# Altium project Air_Logger_PCB.PrjPcb
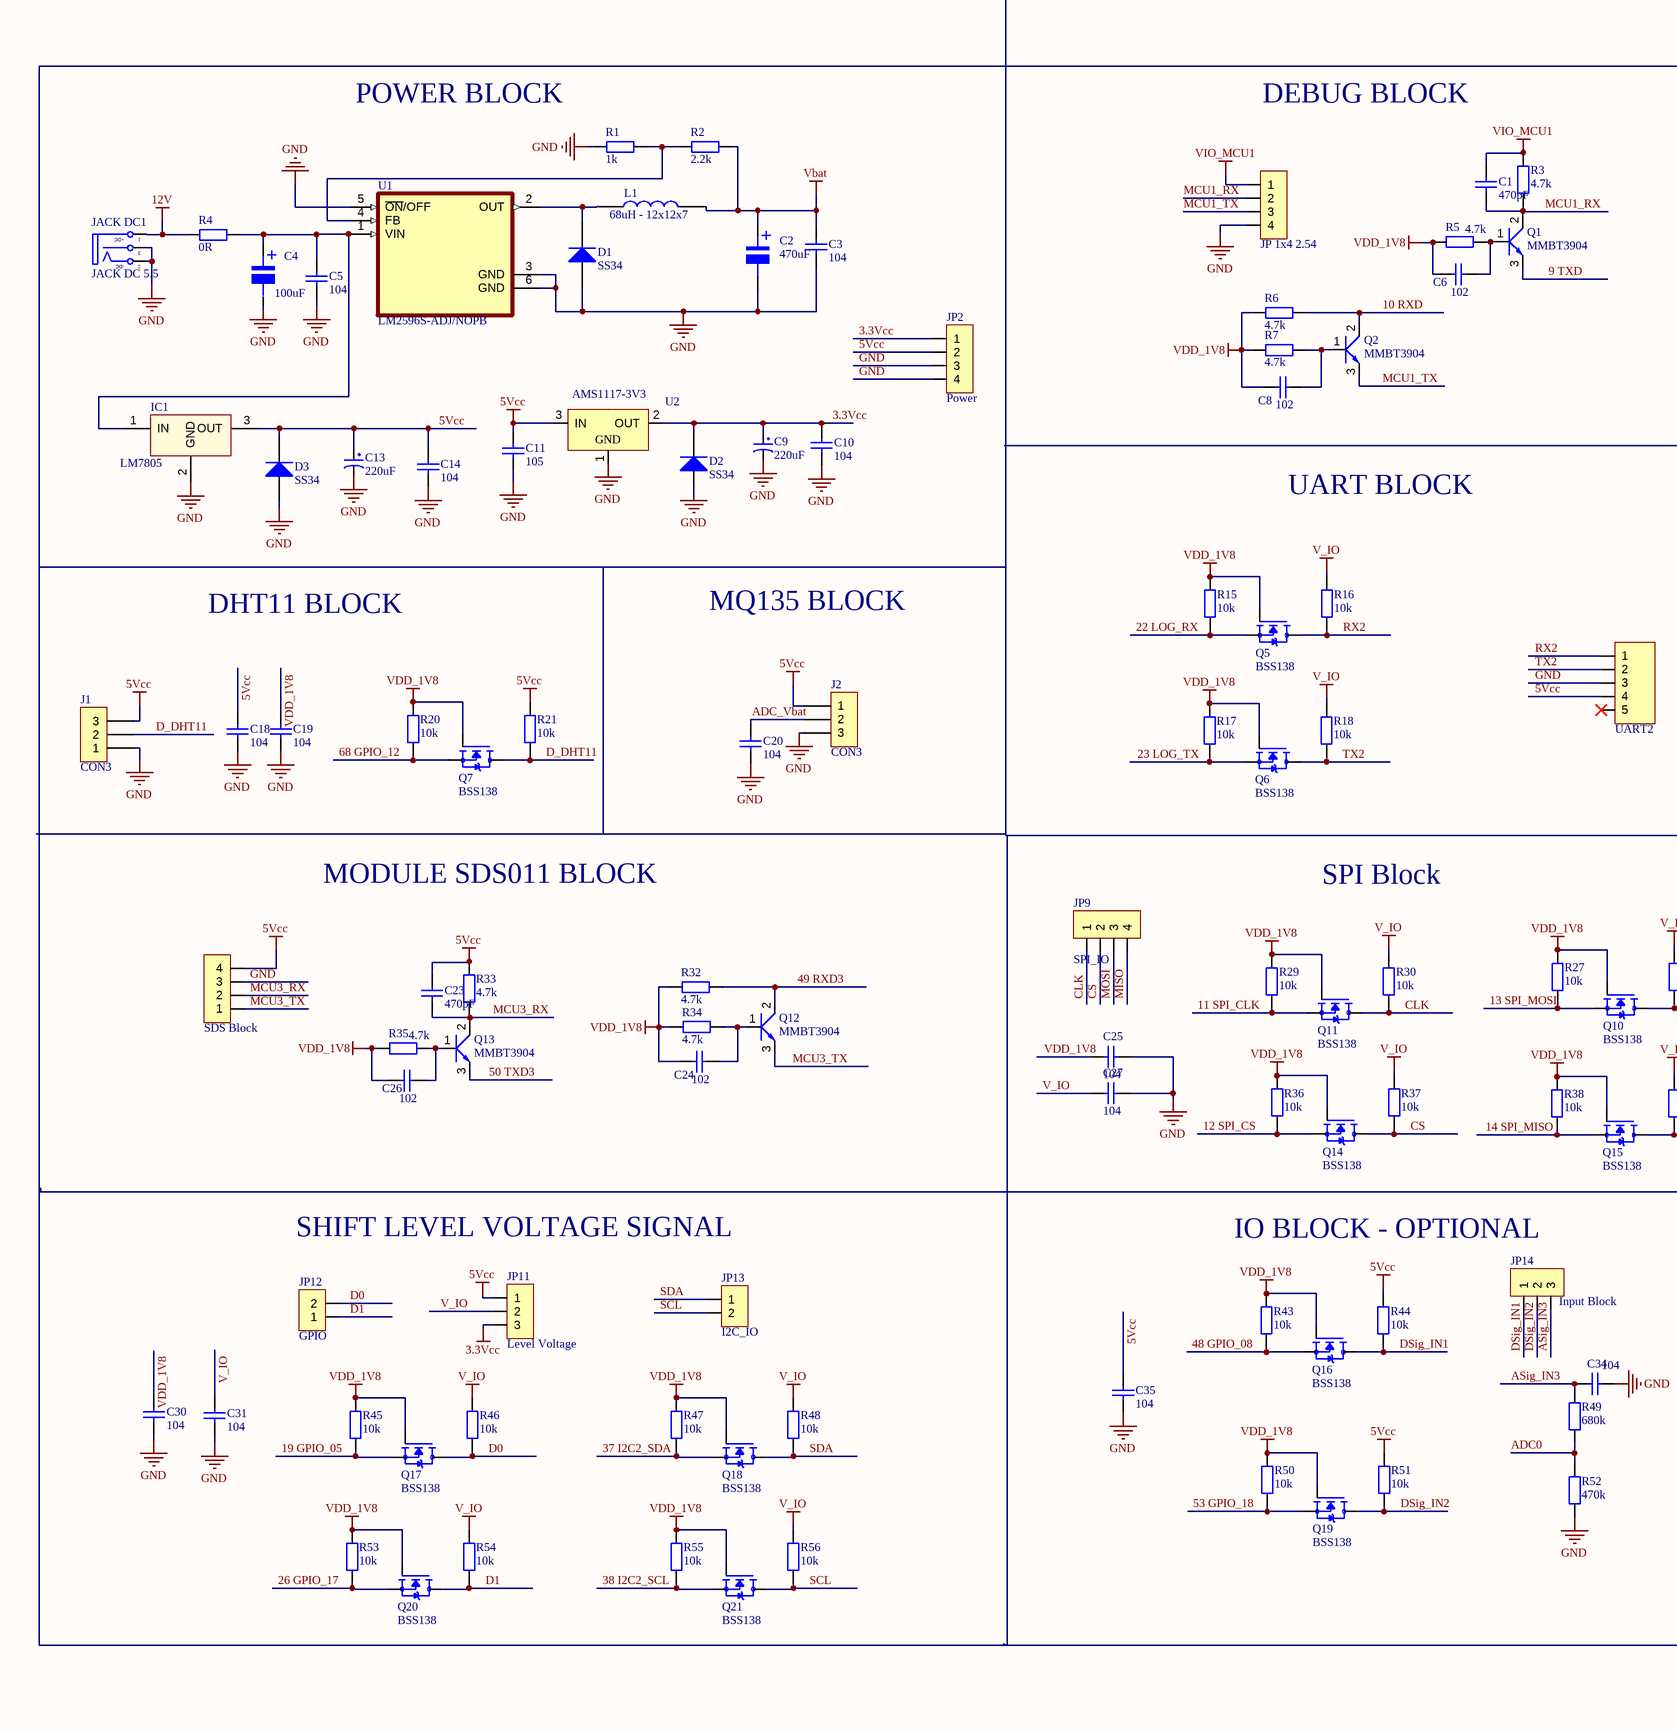
[diagram p0: Air_Logger_Sch_ver2.SchDoc, left]
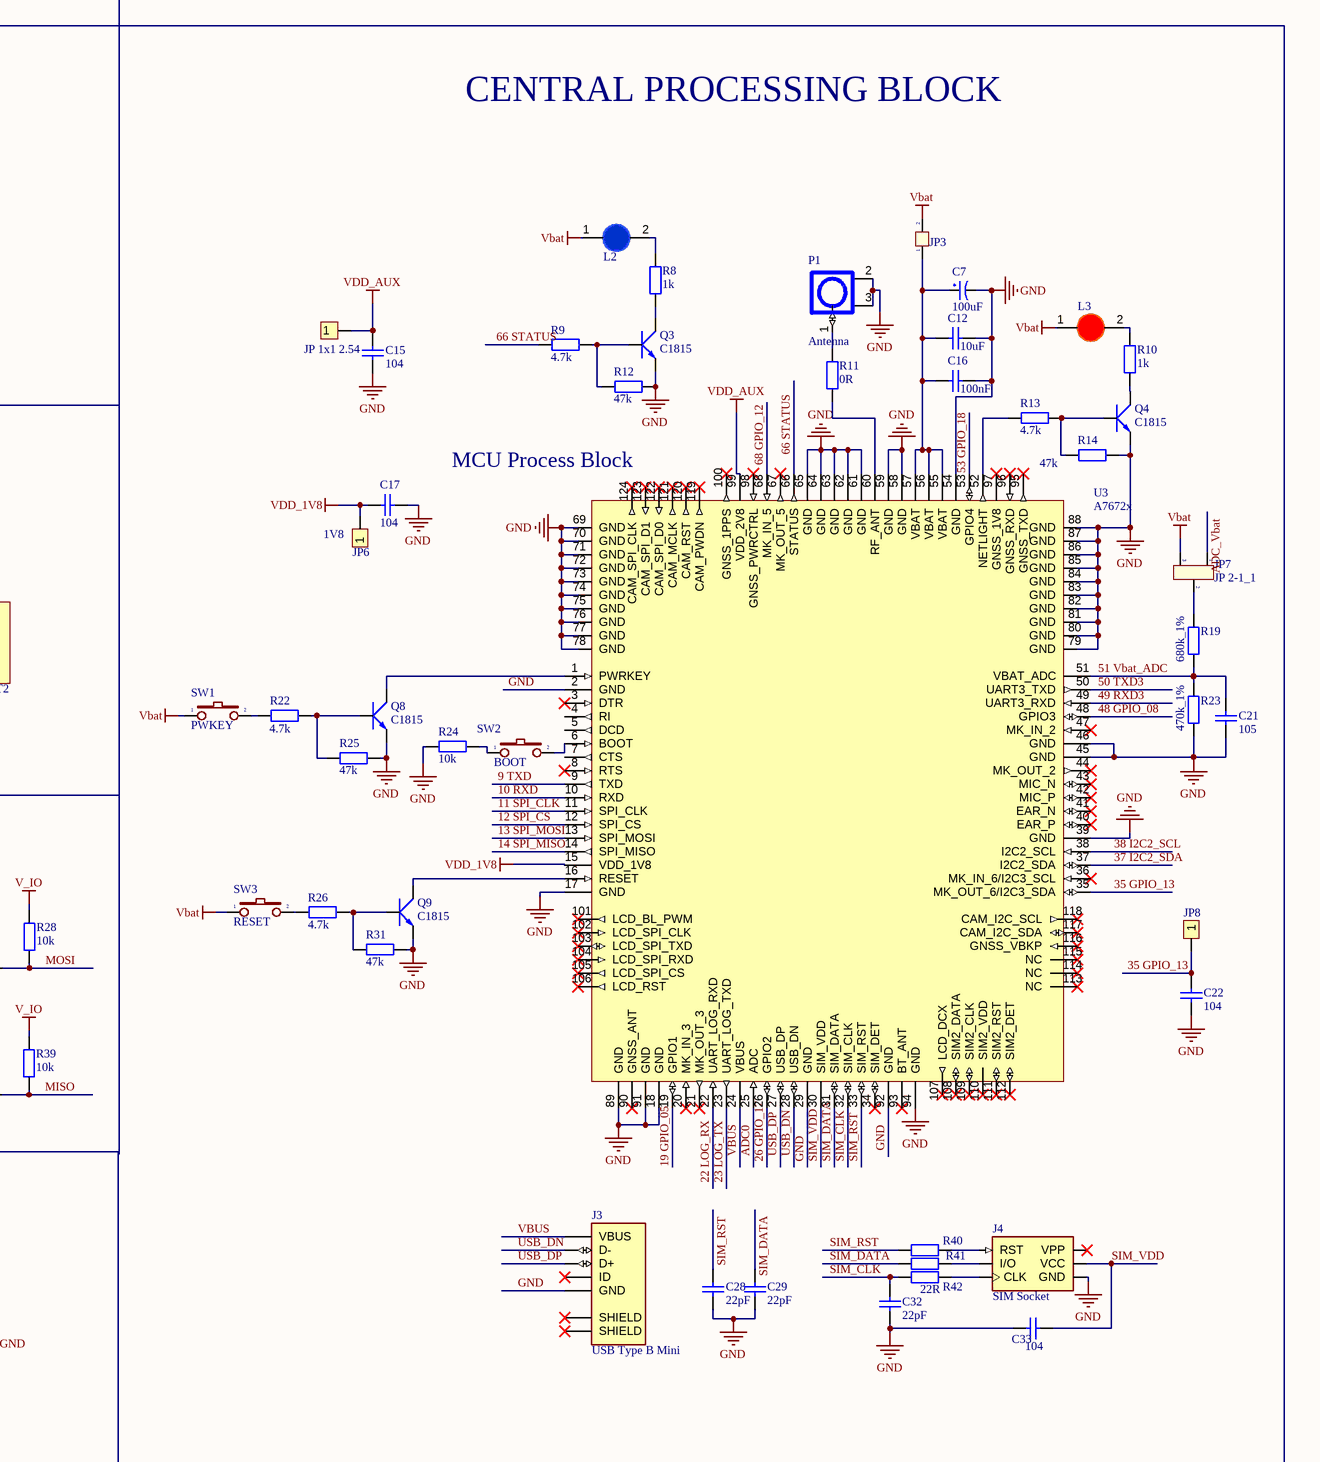
[diagram p1: Air_Logger_Sch_ver2.SchDoc, right]
1 sheet, 145 parts. Net scope: global (net labels, ports and power ports of the same name join across sheets).
Board file: Air_Logger_PCB_ver2.PcbDoc

## Sheet Air_Logger_Sch_ver2.SchDoc
size 594 x 420 mm; SheetNumber: 1; SheetTotal: 1

### Parts
C1  470pF  [tu 1206]
C2  470uF  [tu nhom 8 (f)]
C3  104  [tu 1206]
C4  100uF  [tu nhom 6.3 (d)]
C5  104  [tu 1206]
C6  102  [tu 1206]
C7  100uF  [tu tantalum smd6032]
C8  102  [tu 1206]
C9  220uF  [tu tantalum smd7343]
C10  104  [tu 1206]
C11  105  [tu 1206]
C12  10uF  [tu 1206]
C13  220uF  [tu tantalum smd7343]
C14  104  [tu 1206]
C15  104  [tu 0805]
C16  100nF  [tu 1206]
C17  104  [tu 1206]
C18  104  [tu 0805]
C19  104  [tu 0805]
C20  104  [tu 0805]
C21  105  [tu 0805]
C22  104  [tu 0805]
C23  470pF  [tu 1206]
C24  102  [tu 1206]
C25  104  [tu 0805]
C26  102  [tu 1206]
C27  104  [tu 0805]
C28  22pF  [tu 0805]
C29  22pF  [tu 0805]
C30  104  [tu 0805]
C31  104  [tu 0805]
C32  22pF  [tu 0805]
C33  104  [tu 1206]
C34  104  [tu 0805]
C35  104  [tu 0805]
D1  SS34  [DIODE SMA]
D2  SS34  [DIODE SMA]
D3  SS34  [DIODE SMA]
IC1  LM7805  [TO-252]
J1  CON3  [CON3]
J2  CON3  [CON3]
J3  USB Type B Mini  [GCT_USB3106-XX-0230-X_REVB]
J4  SIM Socket  [GCT_SIM5051-6-0-18-00-X_REVF]
JACK_DC1  JACK DC 5.5  [JACK DC 5.5]
JP1  JP 1x4 2.54  [JP 1x4 DT]
JP2  Power  [JP 1x4 DT]
JP3  Jumper 2  [J2]  (value not drawn)
JP4  JP 1x1 2.54  [JP 1x1 DT]
JP5  UART2  [JP 1x5 DT]
JP6  1V8  [JP 1x1 DT]
JP7  JP 2-1_1  [JP3]
JP8  JP 1x1 2.54  [JP 1x1 DT]  (value not drawn)
JP9  SPI_IO  [JP 1x4 DT]
JP10  SDS Block  [JP 1x4 DT]
JP11  Level Voltage  [JP 1x3 DT]
JP12  GPIO  [JP 1x2 DT]
JP13  I2C_IO  [JP 1x2 DT]
JP14  Input Block  [JP 1x3 DT]
L1  68uH - 12x12x7  [Cuon Cam 12x12x10]
L2  LED 0805  [LED-1206-Blue]  (value not drawn)
L3  LED 0805  [LED-1206-Red]  (value not drawn)
P1  Antenna  [IPXS]
Q1  MMBT3904  [SOT23B C1815]
Q2  MMBT3904  [SOT23B C1815]
Q3  C1815  [SOT23B]
Q4  C1815  [SOT23B]
Q5  BSS138  [SOT95P240X111-3N]
Q6  BSS138  [SOT95P240X111-3N]
Q7  BSS138  [SOT95P240X111-3N]
Q8  C1815  [SOT23B]
Q9  C1815  [SOT23B]
Q10  BSS138  [SOT95P240X111-3N]
Q11  BSS138  [SOT95P240X111-3N]
Q12  MMBT3904  [SOT23B C1815]
Q13  MMBT3904  [SOT23B C1815]
Q14  BSS138  [SOT95P240X111-3N]
Q15  BSS138  [SOT95P240X111-3N]
Q16  BSS138  [SOT95P240X111-3N]
Q17  BSS138  [SOT95P240X111-3N]
Q18  BSS138  [SOT95P240X111-3N]
Q19  BSS138  [SOT95P240X111-3N]
Q20  BSS138  [SOT95P240X111-3N]
Q21  BSS138  [SOT95P240X111-3N]
R1  1k  [tro smd 1206]
R2  2.2k  [tro smd 1206]
R3  4.7k  [tro smd 1206]
R4  0R  [tro smd 1206]
R5  4.7k  [tro smd 1206]
R6  4.7k  [tro smd 1206]
R7  4.7k  [tro smd 1206]
R8  1k  [tro smd 0805]
R9  4.7k  [tro smd 0805]
R10  1k  [tro smd 0805]
R11  0R  [tro smd 0805]
R12  47k  [tro smd 1206]
R13  4.7k  [tro smd 0805]
R14  47k  [tro smd 1206]
R15  10k  [tro smd 1206]
R16  10k  [tro smd 1206]
R17  10k  [tro smd 1206]
R18  10k  [tro smd 1206]
R19  680k_1%  [Tro SMD 0805]
R20  10k  [tro smd 1206]
R21  10k  [tro smd 1206]
R22  4.7k  [tro smd 0805]
R23  470k_1%  [tro smd 0805]
R24  10k  [tro smd 1206]
R25  47k  [tro smd 1206]
R26  4.7k  [tro smd 0805]
R27  10k  [tro smd 1206]
R28  10k  [tro smd 1206]
R29  10k  [tro smd 1206]
R30  10k  [tro smd 1206]
R31  47k  [tro smd 1206]
R32  4.7k  [tro smd 1206]
R33  4.7k  [tro smd 1206]
R34  4.7k  [tro smd 1206]
R35  4.7k  [tro smd 1206]
R36  10k  [tro smd 1206]
R37  10k  [tro smd 1206]
R38  10k  [tro smd 1206]
R39  10k  [tro smd 1206]
R40  22R  [Tro smd 1206]  (value not drawn)
R41  22R  [Tro smd 1206]  (value not drawn)
R42  22R  [Tro smd 1206]
R43  10k  [tro smd 1206]
R44  10k  [tro smd 1206]
R45  10k  [tro smd 1206]
R46  10k  [tro smd 1206]
R47  10k  [tro smd 1206]
R48  10k  [tro smd 1206]
R49  680k  [Tro SMD 0805]
R50  10k  [tro smd 1206]
R51  10k  [tro smd 1206]
R52  470k  [tro smd 0805]
R53  10k  [tro smd 1206]
R54  10k  [tro smd 1206]
R55  10k  [tro smd 1206]
R56  10k  [tro smd 1206]
SW1  PWKEY  [sw_ran_2pin]
SW2  BOOT  [sw_ran_2pin]
SW3  RESET  [sw_ran_2pin]
U1  LM2596S-ADJ/NOPB  [VREG_LM2596S-ADJ/NOPB]
U2  AMS1117-3V3  [AMS1117-3.3V]
U3  A7672x  [A7672]

### Nets
3.3Vcc: C9.1 C10.1 D2.2(K) JP2.1 JP11.3 U2.2(OUT)
5Vcc: C11.1 C13.1 C14.1 C18.1 C23.1 C35.1 D3.2(K) IC1.3(OUT) J1.3 J2.1 JP2.2 JP5.4 JP10.4 JP11.1 R21.2 R33.2 R44.2 R51.2 U2.3(IN)
12V: JACK_DC1.1(T) R4.1
GND: C2.2 C3.2 C4.2 C5.2 C7.2 C9.2 C10.2 C11.2 C12.1 C13.2 C14.2 C15.2 C16.1 C17.2 C18.2 C19.2 C20.2 C21.2 C22.2 C25.1 C27.1 C28.2 C29.2 C30.2 C31.2 C32.2 C33.2 C34.1 C35.2 D1.1(A) D2.1(A) D3.1(A) IC1.2(GND) J1.1 J2.3 J3.5(GND) J4.C5(GND) JACK_DC1.2(TN) JACK_DC1.3(S) JP1.4 JP2.3 JP2.4 JP5.3 JP10.3 P1.2 P1.3 Q3.1(E) Q4.1(E) Q8.1(E) Q9.1(E) R1.2 R12.2 R14.1 R23.1 R24.1 R25.1 R31.2 R52.1 U1.3(GND) U1.5(~{ON}/OFF) U1.6(GND) U2.1(GND) U3.2(GND) U3.17(GND) U3.18(GND) U3.29(GND) U3.39(GND) U3.45(GND) U3.46(GND) U3.54(GND) U3.58(GND) U3.59(GND) U3.61(GND) U3.62(GND) U3.63(GND) U3.64(GND) U3.65(GND) U3.69(GND) U3.70(GND) U3.71(GND) U3.72(GND) U3.73(GND) U3.74(GND) U3.75(GND) U3.76(GND) U3.77(GND) U3.78(GND) U3.79(GND) U3.80(GND) U3.81(GND) U3.82(GND) U3.83(GND) U3.84(GND) U3.85(GND) U3.86(GND) U3.87(GND) U3.88(GND) U3.89(GND) U3.91(GND) U3.92(GND) U3.94(GND)
V_IO: C27.2 C31.1 JP11.2 R16.2 R18.2 R28.2 R30.2 R37.2 R39.2 R46.2 R48.2 R54.2 R56.2
Vbat: C2.1 C3.1 JP3.2 JP7.3 L1.2 L2.1(A) L3.1(A) R2.2 SW1.1 SW3.1
VDD_1V8: C6.2 C8.2 C17.1 C19.1 C24.2 C25.2 C26.2 C30.1 JP6.1 Q5.1(G) Q6.1(G) Q7.1(G) Q10.1(G) Q11.1(G) Q14.1(G) Q15.1(G) Q16.1(G) Q17.1(G) Q18.1(G) Q19.1(G) Q20.1(G) Q21.1(G) R5.1 R6.1 R7.1 R15.2 R17.2 R20.2 R27.2 R29.2 R32.1 R34.1 R35.1 R36.2 R38.2 R43.2 R45.2 R47.2 R50.2 R53.2 R55.2 U3.15(VDD_1V8)
VDD_AUX: C15.1 JP4.1 U3.99(VDD_2V8)
VIO_MCU1: C1.1 JP1.1 R3.2
9 TXD: Q1.3(E) U3.9(TXD)
10 RXD: Q2.2(C) R6.2 U3.10(RXD)
11 SPI_CLK: Q11.2(S) R29.1 U3.11(SPI_CLK)
12 SPI_CS: Q14.2(S) R36.1 U3.12(SPI_CS)
13 SPI_MOSI: Q10.2(S) R27.1 U3.13(SPI_MOSI)
14 SPI_MISO: Q15.2(S) R38.1 U3.14(SPI_MISO)
19 GPIO_05: Q17.2(S) R45.1 U3.19(GPIO1)
22 LOG_RX: Q5.2(S) R15.1 U3.22(UART_LOG_RXD)
23 LOG_TX: Q6.2(S) R17.1 U3.23(UART_LOG_TXD)
26 GPIO_17: Q20.2(S) R53.1 U3.26(GPIO2)
35 GPIO_13: C22.1 JP8.1 U3.35(MK_OUT_6/I2C3_SDA)
37 I2C2_SDA: Q18.2(S) R47.1 U3.37(I2C2_SDA)
38 I2C2_SCL: Q21.2(S) R55.1 U3.38(I2C2_SCL)
48 GPIO_08: Q16.2(S) R43.1 U3.48(GPIO3)
49 RXD3: Q12.2(C) R32.2 U3.49(UART3_RXD)
50 TXD3: Q13.3(E) U3.50(UART3_TXD)
51 Vbat_ADC: C21.1 R19.1 R23.2 U3.51(VBAT_ADC)
53 GPIO_18: Q19.2(S) R50.1 U3.53(GPIO4)
66 STATUS: R9.1 U3.66(STATUS)
68 GPIO_12: Q7.2(S) R20.1 U3.68(MK_IN_5)
ADC0: R49.1 R52.2 U3.25(ADC)
ADC_Vbat: C20.1 J2.2 JP7.1
ASig_IN3: C34.2 JP14.3 R49.2
CLK: JP9.1 Q11.3(D) R30.1
CS: JP9.2 Q14.3(D) R37.1
D0: JP12.2 Q17.3(D) R46.1
D1: JP12.1 Q20.3(D) R54.1
D_DHT11: J1.2 Q7.3(D) R21.1
DSig_IN1: JP14.1 Q16.3(D) R44.1
DSig_IN2: JP14.2 Q19.3(D) R51.1
MCU1_RX: C1.2 JP1.2 Q1.2(C) R3.1
MCU1_TX: JP1.3 Q2.3(E)
MCU3_RX: C23.2 JP10.2 Q13.2(C) R33.1
MCU3_TX: JP10.1 Q12.3(E)
MISO: JP9.4 Q15.3(D) R39.1
MOSI: JP9.3 Q10.3(D) R28.1
RX2: JP5.1 Q5.3(D) R16.1
SCL: JP13.2 Q21.3(D) R56.1
SDA: JP13.1 Q18.3(D) R48.1
SIM_CLK: C32.1 R42.1 U3.32(SIM_CLK)
SIM_DATA: C29.1 R41.1 U3.31(SIM_DATA)
SIM_RST: C28.1 R40.1 U3.33(SIM_RST)
SIM_VDD: C33.1 J4.C1(VCC) U3.30(SIM_VDD)
TX2: JP5.2 Q6.3(D) R18.1
USB_DN: J3.2(D-) U3.28(USB_DN)
USB_DP: J3.3(D+) U3.27(USB_DP)
VBUS: J3.1(VBUS) U3.24(VBUS)
NetC4_1: C4.1 C5.1 IC1.1(IN) R4.2 U1.1(VIN)
NetC6_1: C6.1 Q1.1(B) R5.2
NetC7_1: C7.1 C12.2 C16.2 JP3.1 U3.55(VBAT) U3.56(VBAT) U3.57(VBAT)
NetC8_1: C8.1 Q2.1(B) R7.2
NetC24_1: C24.1 Q12.1(B) R34.2
NetC26_1: C26.1 Q13.1(B) R35.2
NetD1_2: D1.2(K) L1.1 U1.2(OUT)
NetJ4_C2: J4.C2(RST) R40.2
NetJ4_C3: J4.C3(CLK) R42.2
NetJ4_C7: J4.C7(I/O) R41.2
NetJP7_2: JP7.2 R19.2
NetL2_2: L2.2(K) R8.1
NetL3_2: L3.2(K) R10.2
NetP1_1: P1.1 R11.2
NetQ3_2: Q3.2(C) R8.2
NetQ3_3: Q3.3(B) R9.2 R12.1
NetQ4_2: Q4.2(C) R10.1
NetQ4_3: Q4.3(B) R13.2 R14.2
NetQ8_2: Q8.2(C) U3.1(PWRKEY)
NetQ8_3: Q8.3(B) R22.2 R25.2
NetQ9_2: Q9.2(C) U3.16(RESET)
NetQ9_3: Q9.3(B) R26.2 R31.1
NetR1_1: R1.1 R2.1 U1.4(FB)
NetR11_1: R11.1 U3.60(RF_ANT)
NetR13_1: R13.1 U3.52(NETLIGHT)
NetR22_1: R22.1 SW1.2
NetR24_2: R24.2 SW2.1
NetR26_1: R26.1 SW3.2
NetSW2_2: SW2.2 U3.6(BOOT)

Not connected (* = marked no-connect by the designer): J3 4(ID)* 6(SHIELD)* 7(SHIELD)*; J4 C6(VPP)*; JP5 5*; U2 4(OUT); U3 3(DTR)* 4(RI) 5(DCD) 7(CTS) 8(RTS)* 20(MK_IN_3)* 21(MK_OUT_3)* 34(SIM_DET)* 36(MK_IN_6/I2C3_SCL)* 40(EAR_P)* 41(EAR_N)* 42(MIC_P)* 43(MIC_N)* 44(MK_OUT_2)* 47(MK_IN_2)* 67(MK_OUT_5)* 90(GNSS_ANT)* 93(BT_ANT)* 95(GNSS_TXD)* 96(GNSS_RXD)* 97(GNSS_1V8)* 98(GNSS_PWRCTRL)* 100(GNSS_1PPS)* 101(LCD_BL_PWM)* 102(LCD_SPI_CLK)* 103(LCD_SPI_TXD)* 104(LCD_SPI_RXD)* 105(LCD_SPI_CS)* 106(LCD_RST)* 107(LCD_DCX)* 108(SIM2_DATA)* 109(SIM2_CLK)* 110(SIM2_VDD)* 111(SIM2_RST)* 112(SIM2_DET)* 113(NC)* 114(NC)* 115(NC)* 116(GNSS_VBKP)* 117(CAM_I2C_SDA)* 118(CAM_I2C_SCL)* 119(CAM_PWDN)* 120(CAM_RST)* 121(CAM_MCLK)* 122(CAM_SPI_D0)* 123(CAM_SPI_D1)* 124(CAM_SPI_CLK)*

### Notes on the sheet
- POWER BLOCK
- DEBUG BLOCK
- CENTRAL PROCESSING BLOCK
- UART BLOCK
- (near U3) MCU Process Block
- DHT11 BLOCK
- MQ135 BLOCK
- MODULE SDS011 BLOCK
- SPI Block
- SHIFT LEVEL VOLTAGE SIGNAL
- IO BLOCK - OPTIONAL
- DWG NO:
- REV:
- THIS DOCUMENT AND THE DATA DISCLOSED HEREIN OR
- HEREWITH IS THE PROPERTY OF ALTIUM LIMITED AND MAY
- BE FREELY DISTRIBUTED IN WHOLE. NO RIGHTS ARE
- RESERVED OR EXPRESS OR IMPLIED WARANTEE GIVEN.
- REVISION
- DESCRIPTION
- DATE
- APPROVED
- ENG:
- APPROVALS
- PROJECT
- DSN:
- CHK:
- REFERENCE DOCUMENTS
- PROJECT REVISION:
- TITLE
- DOCUMENT REVISION:
- DESIGN ITEM:
- BOM:
- FAB DWG:
- PCB DWG:
- ASSY DWG:
- SCALE:
- A2
- SIZE
- CAGE CODE
- FILE NAME
- DWG NO.
- SHEET
- OF
- REV
- (in symbol JACK DC 5.5) +DC; -DC
- (in symbol Tu Nhom 100uF 16V) +
- (in symbol Tu Nhom 470uF 16V) +

### Library data of the parts
C1 C23 = Tu 1206 470pF 50V 10%: Dán; Don_Vi: Con; So_Chan: 2; Ten_Linh_Kien: Tụ 1206 470P 10% 50V; Ma_Hang: MH004548; Chung_Loai: Dán; Kieu_Chan: *
C2 = Tu Nhom 470uF 16V: Dán; Don_Vi: Con; So_Chan: 2; Ten_Linh_Kien: Tụ Nhôm 470uF 16V 8x10.4MM; Ma_Hang: MH001940; Chung_Loai: Dán; Kieu_Chan: *
C3 C5 C10 C14 C16 C17 C33 = Tu 1206 104 50V 20%: Dán; Don_Vi: Con; So_Chan: 2; Ten_Linh_Kien: Tụ 1206 104-0.1uF 20% 50V; Ma_Hang: MH004544; Chung_Loai: Dán; Kieu_Chan: *
C4 = Tu Nhom 100uF 16V: Dán; Don_Vi: Con; So_Chan: 2; Ten_Linh_Kien: Tụ Nhôm 100uF 16V 6.3x5.4MM; Ma_Hang: MH002219; Chung_Loai: Dán; Kieu_Chan: *
C6 C8 C24 C26 = Tu 1206 102 50V 10%: Dán; Don_Vi: Con; So_Chan: 2; Ten_Linh_Kien: Tụ 1206 102-1nF 10% 50V; Ma_Hang: MH004542; Chung_Loai: Dán; Kieu_Chan: *
C7 = Tu tantalum 100uF 10V SMD6032: Dán; Don_Vi: Con; So_Chan: 2; Ten_Linh_Kien: Tụ tantalum 107A-100uF 10V SMD6032; Ma_Hang: MH007594; Chung_Loai: Dán; Kieu_Chan: *
C9 C13 = Tu tantalum 220uF 16V SMD7343: Dán; Don_Vi: Con; So_Chan: 2; Ten_Linh_Kien: Tụ tantalum 227C-220uF 16V SMD7343; Ma_Hang: MH002345; Chung_Loai: Dán; Kieu_Chan: *
C11 = Tu 1206 105 50V 20%: Dán; Don_Vi: Con; So_Chan: 2; Ten_Linh_Kien: Tụ 1206 105-1uF 20% 50V; Ma_Hang: MH004545; Chung_Loai: Dán; Kieu_Chan: *
C12 = Tu 1206 106 16V 20%: Dán; Don_Vi: Con; So_Chan: 2; Ten_Linh_Kien: Tụ 1206 106-10uF 20% 16V; Ma_Hang: MH004541; Chung_Loai: Dán; Kieu_Chan: *
C15 C18-C20 C22 C25 C27 C30 C31 C34 C35 = Tu 0805 104 50V 10%: Dán; Don_Vi: Con; So_Chan: 2; Ten_Linh_Kien: Tụ 0805 104-100nF 10% 50V; Ma_Hang: MH004551; Chung_Loai: Dán; Kieu_Chan: *
C21 = Tu 0805 105 50V 10%: Dán; Don_Vi: Con; So_Chan: 2; Ten_Linh_Kien: Tụ 0805 105-1uF 10% 50V; Ma_Hang: MH004552; Chung_Loai: Dán; Kieu_Chan: *
C28 C29 C32 = Tu 0805 22pF 50V 10%: Dán; Don_Vi: Con; So_Chan: 2; Ten_Linh_Kien: Tụ 0805 22P 10% 50V; Ma_Hang: MH004560; Chung_Loai: Dán; Kieu_Chan: *
D1-D3 = Diode SS34 ( 1N5822 ): Dán; Don_Vi: Con; Ma_Hang: MH002104; Ten_Linh_Kien: Diode SS34 3A 40V SMA ( 1N5822 SS34A); Kieu_Chan: *; Chung_Loai: Dán
IC1 = LM78xx: On ap +, from + 5 to + 24VDC; Value: LM7805
J1 J2 = CON3: Connector
J3 = USB3106-XX-0230-X_REVB: USB - micro AB USB 2.0 Receptacle Connector 5 Position Through Hole; MP: USB3106-30-0230-A; MF: Global Connector Technology; Price: None; SnapEDA_Link: https://www.snapeda.com/parts/USB3106-30-0230-A/Global%20Connector%20Technology/view-part/491956/?ref=snap; Availability: Unavailable; Value: *; Package: None
J4 = SIM5051-6-0-18-00-X_REVF: Memory Socket, Sim Card, 6pos; MP: SIM5051-6-0-18-00-A REV C; MF: Global Connector Technology; Availability: Unavailable; SnapEDA_Link: https://www.snapeda.com/parts/SIM5051-6-0-18-00-A%20REV%20C/Global%20Connector%20Technology/view-part/812969/?ref=snap; Price: None; Package: None; Value: *
JACK_DC1 = JACK DC 5.5: Value: Jac DC
JP1 JP2 JP9 JP10 = JP 1x4 2.54 Duc Thang: Cắm; Ten_Linh_Kien: Jump Đơn Đực 2.54MM 1x40P Thẳng 11MM; Don_Vi: Con; Ma_Hang: MH000903; Ghi_Chu: *; Kieu_Chan: *; Chung_Loai: Cắm
JP3 = JP 2_1: Value: JP 2
JP4 JP6 JP8 = JP 1x1 2.54 Duc Cong: Cắm; Ten_Linh_Kien: Jump Đơn Đực 2.54MM 1x40P Cong Đứng; Don_Vi: Con; Ma_Hang: MH000904; Ghi_Chu: *; Kieu_Chan: *; Chung_Loai: Cắm
JP5 = JP 1x5 2.54 Duc Thang: Cắm; Ten_Linh_Kien: Jump Đơn Đực 2.54MM 1x40P Thẳng 11MM; Don_Vi: Con; Ma_Hang: MH000903; Ghi_Chu: *; Kieu_Chan: *; Chung_Loai: Cắm
JP7 = JP 2-1_1: Jumper 2-1; Value: J2-1
JP11 JP14 = JP 1x3 2.54 Duc Thang: Cắm; Ten_Linh_Kien: Jump Đơn Đực 2.54MM 1x40P Thẳng 11MM; Don_Vi: Con; Ma_Hang: MH000903; Ghi_Chu: *; Kieu_Chan: *; Chung_Loai: Cắm
JP12 JP13 = JP 1x2 2.54 Duc Thang: Cắm; Ten_Linh_Kien: Jump Đơn Đực 2.54MM 1x40P Thẳng 11MM; Don_Vi: Con; Ma_Hang: MH000903; Ghi_Chu: *; Kieu_Chan: *; Chung_Loai: Cắm
L1 = CUON CAM 100uH SMD: Dán; Don_Vi: Con; Ma_Hang: MH003999; Ten_Linh_Kien: Cuộn Cảm 100uH 7x7x4MM CD74; Ma_Hang: *; Kieu_Chan: *; Chung_Loai: Dán
L2 = LED 1206 Xanh Duong: Dán; Don_Vi: Con; Ma_Hang: MH002333; Ten_Linh_Kien: LED1206 Màu Xanh Dương (Blue); Ghi_Chu: *; Kieu_Chan: *; Chung_Loai: Dán
L3 = LED 1206 Do: Dán; Don_Vi: Con; Ma_Hang: MH002334; Ten_Linh_Kien: LED1206 Màu Đỏ (Red); Ghi_Chu: *; Kieu_Chan: *; Chung_Loai: Dán
P1 = IPXSx66: Antenna GSM GPS
Q1 Q2 Q12 Q13 = C1815_2: NPN 600mW, ECB; Value: C1815
Q3 Q4 Q8 Q9 = C1815: NPN 600mW, ECB; Value: C1815
Q5-Q7 Q10 Q11 Q14-Q21 = BSS138: N-Channel 50V 220mA (Ta) 360mW (Ta) Surface Mount SOT-23-3; MF: ON Semiconductor; MP: BSS138; Price: None; SnapEDA_Link: https://www.snapeda.com/parts/BSS138/ON%20Semiconductor/view-part/4794929/?ref=snap; Availability: Good; Purchase-URL: https://pricing.snapeda.com/search/part/BSS138/?ref=eda; Value: *; Check_prices: https://www.snapeda.com/parts/BSS138/ON%20Semiconductor/view-part/4794929/?ref=eda; Package: SOT-23 ON Semiconductor
R1 = Tro 1206 1% 1k: Dán; Don_Vi: Con; So_Chan: 2; Ten_Linh_Kien: Trở 1206 1% 1k; Ma_Hang: MH005880; Chung_Loai: Dán; Kieu_Chan: *
R2 = Tro 1206 1% 2.2k: Dán; Chung_Loai: Cắm; Don_Vi: Con; So_Chan: 2; Ten_Linh_Kien: Trở 1206 1% 2.2k; Ma_Hang: MH005882; Kieu_Chan: *
R3 R5-R7 R32-R35 = Tro 1206 5% 4.7K: Dán; So_Chan: 2; Don_Vi: Con; Ten_Linh_Kien: Trở 1206 5% 4.7k; Ma_Hang: MH005908; Chung_Loai: Dán; Kieu_Chan: *
R4 = Tro 1206 5% 0R: Dán; Don_Vi: Con; So_Chan: 2; Ten_Linh_Kien: Trở 1206 5% 0R; Ma_Hang: MH005902; Chung_Loai: Dán; Kieu_Chan: *
R8 R10 = Tro 0805 5% 1k: Dán; Don_Vi: Con; So_Chan: 2; Ten_Linh_Kien: Trở 0805 5% 1k; Ma_Hang: MH005234; Chung_Loai: Dán; Kieu_Chan: *
R9 R13 R22 R26 = Tro 0805 5% 4.7k: Dán; Don_Vi: Con; So_Chan: 2; Ten_Linh_Kien: Trở 0805 5% 4.7k; Ma_Hang: MH005307; Chung_Loai: Dán; Kieu_Chan: *
R11 = Tro 0805 5% 0R: Dán; Don_Vi: Con; So_Chan: 2; Ten_Linh_Kien: Trở 0805 5% 0R; Ma_Hang: MH005230; Chung_Loai: Dán; Kieu_Chan: *
R12 R14 R25 R31 = Tro 1206 5% 47k: Dán; Don_Vi: Con; Ten_Linh_Kien: Trở 1206 5% 47k; Ma_Hang: MH005916; So_Chan: 2; Chung_Loai: Dán; Kieu_Chan: *
R15-R18 R20 R21 R27-R30 R36-R39 R43-R48 R50 R51 R53-R56 = Tro 1206 1% 10k: Dán; Don_Vi: Con; So_Chan: 2; Ten_Linh_Kien: Trở 1206 1% 10k; Ma_Hang: MH005885; Chung_Loai: Dán; Kieu_Chan: *
R19 R49 = Tro 0805 5% 680k: Dán; Don_Vi: Con; Ma_Hang: MH005343; Ten_Linh_Kien: Trở 0805 5% 680k; So_Chan: 2; Chung_Loai: Dán; Kieu_Chan: *
R23 R52 = Tro 0805 1% 470k: Dán; Don_Vi: Con; So_Chan: 2; Ten_Linh_Kien: Trở 0805 1% 470k; Ma_Hang: MH005485; Chung_Loai: Dán; Kieu_Chan: *
R24 = Tro 1206 5% 10k: Dán; Don_Vi: Con; So_Chan: 2; Ten_Linh_Kien: Trở 1206 5% 10K; Ma_Hang: MH005909; Chung_Loai: Dán; Kieu_Chan: *
R40-R42 = Tro 1206 5% 22R: Dán; Don_Vi: Con; So_Chan: 2; Ten_Linh_Kien: Trở 1206 5% 22R; Ma_Hang: MH005913; Chung_Loai: Dán; Kieu_Chan: *
SW1-SW3 = SW2: Switch button 2 pin; Value: SW chip 2 pin
U1 = LM2596S-ADJ/NOPB: SIMPLE SWITCHER&reg; 4.5V to 40V, 3A Low Component Count Step-Down Regulator; MF: Texas Instruments; Price: None; Package: TO-263-5 Texas Instruments; Purchase-URL: https://pricing.snapeda.com/search/part/LM2596S-ADJ/NOPB/?ref=eda; Availability: In Stock; SnapEDA_Link: https://www.snapeda.com/parts/LM2596S-ADJ/NOPB/Texas+Instruments/view-part/?ref=snap; Value: *; MP: LM2596S-ADJ/NOPB; Check_prices: https://www.snapeda.com/parts/LM2596S-ADJ/NOPB/Texas+Instruments/view-part/?ref=eda
U2 = AMS1117-3V3: Linear Voltage Regulator 3.3V 1A 15V Max SOT-223; ComponentLink1Description: Datasheet; ComponentLink1URL: D:\Dropbox\Datasheets\Power Management ICs\Linear Regulators\AMS1117.pdf; Unit Price: 0.2000
U3 = A7672x: LTE CAT 1 module, 2,3,4G; MFR: SIMCOM; MPN: A7672S; Company ID: VT_Module_A7672S